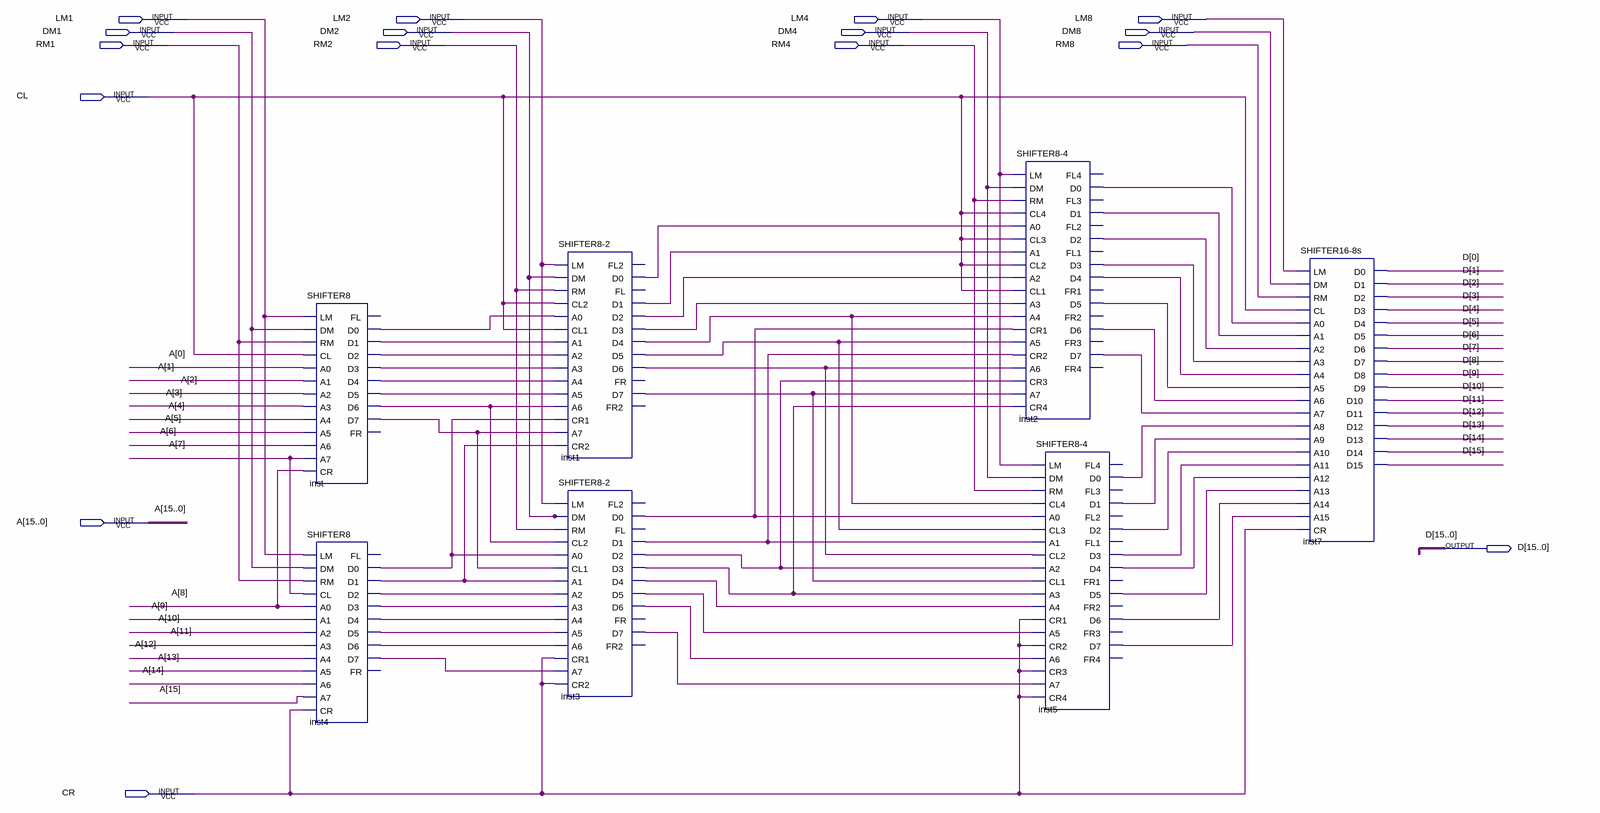
[diagram p0: schematic sheet]
// Quartus schematic SHIFTER16-BIN.bdf as structural Verilog: 7 symbols, 16 pins
module \SHIFTER16-BIN  (
  input  LM1,
  input  LM2,
  input  LM4,
  input  LM8,
  input  DM1,
  input  DM2,
  input  DM4,
  input  DM8,
  input  RM1,
  input  RM2,
  input  RM4,
  input  RM8,
  input  CL,
  input  [15:0] A,
  input  CR,
  output [15:0] D
);

  wire inst1_d0, inst1_d1, inst1_d2, inst1_d3, inst1_d4, inst1_d5, inst1_d6, inst1_d7, inst2_d0, inst2_d1,
       inst2_d2, inst2_d3, inst2_d4, inst2_d5, inst2_d6, inst2_d7, inst3_d0, inst3_d1, inst3_d2, inst3_d3,
       inst3_d4, inst3_d5, inst3_d6, inst3_d7, inst4_d0, inst4_d1, inst4_d2, inst4_d3, inst4_d4, inst4_d5,
       inst4_d6, inst4_d7, inst5_d0, inst5_d1, inst5_d2, inst5_d3, inst5_d4, inst5_d5, inst5_d6, inst5_d7,
       inst_d0, inst_d1, inst_d2, inst_d3, inst_d4, inst_d5, inst_d6, inst_d7;

  SHIFTER8 inst (
    .LM(LM1), .DM(DM1), .RM(RM1), .CL(CL), .A0(A[0]), .A1(A[1]), .A2(A[2]), .A3(A[3]), .A4(A[4]), .A5(A[5]),
    .A6(A[6]), .A7(A[7]), .CR(A[8]), .D0(inst_d0), .D1(inst_d1), .D2(inst_d2), .D3(inst_d3), .D4(inst_d4),
    .D5(inst_d5), .D6(inst_d6), .D7(inst_d7));  // open: FL, FR
  SHIFTER8 inst4 (
    .LM(LM1), .DM(DM1), .RM(RM1), .CL(A[7]), .A0(A[8]), .A1(A[9]), .A2(A[10]), .A3(A[11]), .A4(A[12]),
    .A5(A[13]), .A6(A[14]), .A7(A[15]), .CR(CR), .D0(inst4_d0), .D1(inst4_d1), .D2(inst4_d2), .D3(inst4_d3),
    .D4(inst4_d4), .D5(inst4_d5), .D6(inst4_d6), .D7(inst4_d7));  // open: FL, FR
  \SHIFTER8-2  inst1 (
    .LM(LM2), .DM(DM2), .RM(RM2), .CL2(CL), .A0(inst_d0), .CL1(CL), .A1(inst_d1), .A2(inst_d2), .A3(inst_d3),
    .A4(inst_d4), .A5(inst_d5), .A6(inst_d6), .CR1(inst4_d0), .A7(inst_d7), .CR2(inst4_d1), .D0(inst1_d0),
    .D1(inst1_d1), .D2(inst1_d2), .D3(inst1_d3), .D4(inst1_d4), .D5(inst1_d5), .D6(inst1_d6), .D7(inst1_d7));  // open: FL2, FL, FR, FR2
  \SHIFTER8-2  inst3 (
    .LM(LM2), .DM(DM2), .RM(RM2), .CL2(inst_d6), .A0(inst4_d0), .CL1(inst_d7), .A1(inst4_d1), .A2(inst4_d2),
    .A3(inst4_d3), .A4(inst4_d4), .A5(inst4_d5), .A6(inst4_d6), .CR1(CR), .A7(inst4_d7), .CR2(CR),
    .D0(inst3_d0), .D1(inst3_d1), .D2(inst3_d2), .D3(inst3_d3), .D4(inst3_d4), .D5(inst3_d5), .D6(inst3_d6),
    .D7(inst3_d7));  // open: FL2, FL, FR, FR2
  \SHIFTER8-4  inst2 (
    .LM(LM4), .DM(DM4), .RM(RM4), .CL4(CL), .A0(inst1_d0), .CL3(CL), .A1(inst1_d1), .CL2(CL), .A2(inst1_d2),
    .CL1(CL), .A3(inst1_d3), .A4(inst1_d4), .CR1(inst3_d0), .A5(inst1_d5), .CR2(inst3_d1), .A6(inst1_d6),
    .CR3(inst3_d2), .A7(inst1_d7), .CR4(inst3_d3), .D0(inst2_d0), .D1(inst2_d1), .D2(inst2_d2),
    .D3(inst2_d3), .D4(inst2_d4), .D5(inst2_d5), .D6(inst2_d6), .D7(inst2_d7));  // open: FL4, FL3, FL2, FL1, FR1, FR2, FR3, FR4
  \SHIFTER8-4  inst5 (
    .LM(LM4), .DM(DM4), .RM(RM4), .CL4(inst1_d4), .A0(inst3_d0), .CL3(inst1_d5), .A1(inst3_d1),
    .CL2(inst1_d6), .A2(inst3_d2), .CL1(inst1_d7), .A3(inst3_d3), .A4(inst3_d4), .CR1(CR), .A5(inst3_d5),
    .CR2(CR), .A6(inst3_d6), .CR3(CR), .A7(inst3_d7), .CR4(CR), .D0(inst5_d0), .D1(inst5_d1), .D2(inst5_d2),
    .D3(inst5_d3), .D4(inst5_d4), .D5(inst5_d5), .D6(inst5_d6), .D7(inst5_d7));  // open: FL4, FL3, FL2, FL1, FR1, FR2, FR3, FR4
  \SHIFTER16-8s  inst7 (
    .LM(LM8), .DM(DM8), .RM(RM8), .CL(CL), .A0(inst2_d0), .A1(inst2_d1), .A2(inst2_d2), .A3(inst2_d3),
    .A4(inst2_d4), .A5(inst2_d5), .A6(inst2_d6), .A7(inst2_d7), .A8(inst5_d0), .A9(inst5_d1), .A10(inst5_d2),
    .A11(inst5_d3), .A12(inst5_d4), .A13(inst5_d5), .A14(inst5_d6), .A15(inst5_d7), .CR(CR), .D0(D[0]),
    .D1(D[1]), .D2(D[2]), .D3(D[3]), .D4(D[4]), .D5(D[5]), .D6(D[6]), .D7(D[7]), .D8(D[8]), .D9(D[9]),
    .D10(D[10]), .D11(D[11]), .D12(D[12]), .D13(D[13]), .D14(D[14]), .D15(D[15]));
endmodule
